# EAGLE schematic teensy-dsc (EAGLE 7.1.0)
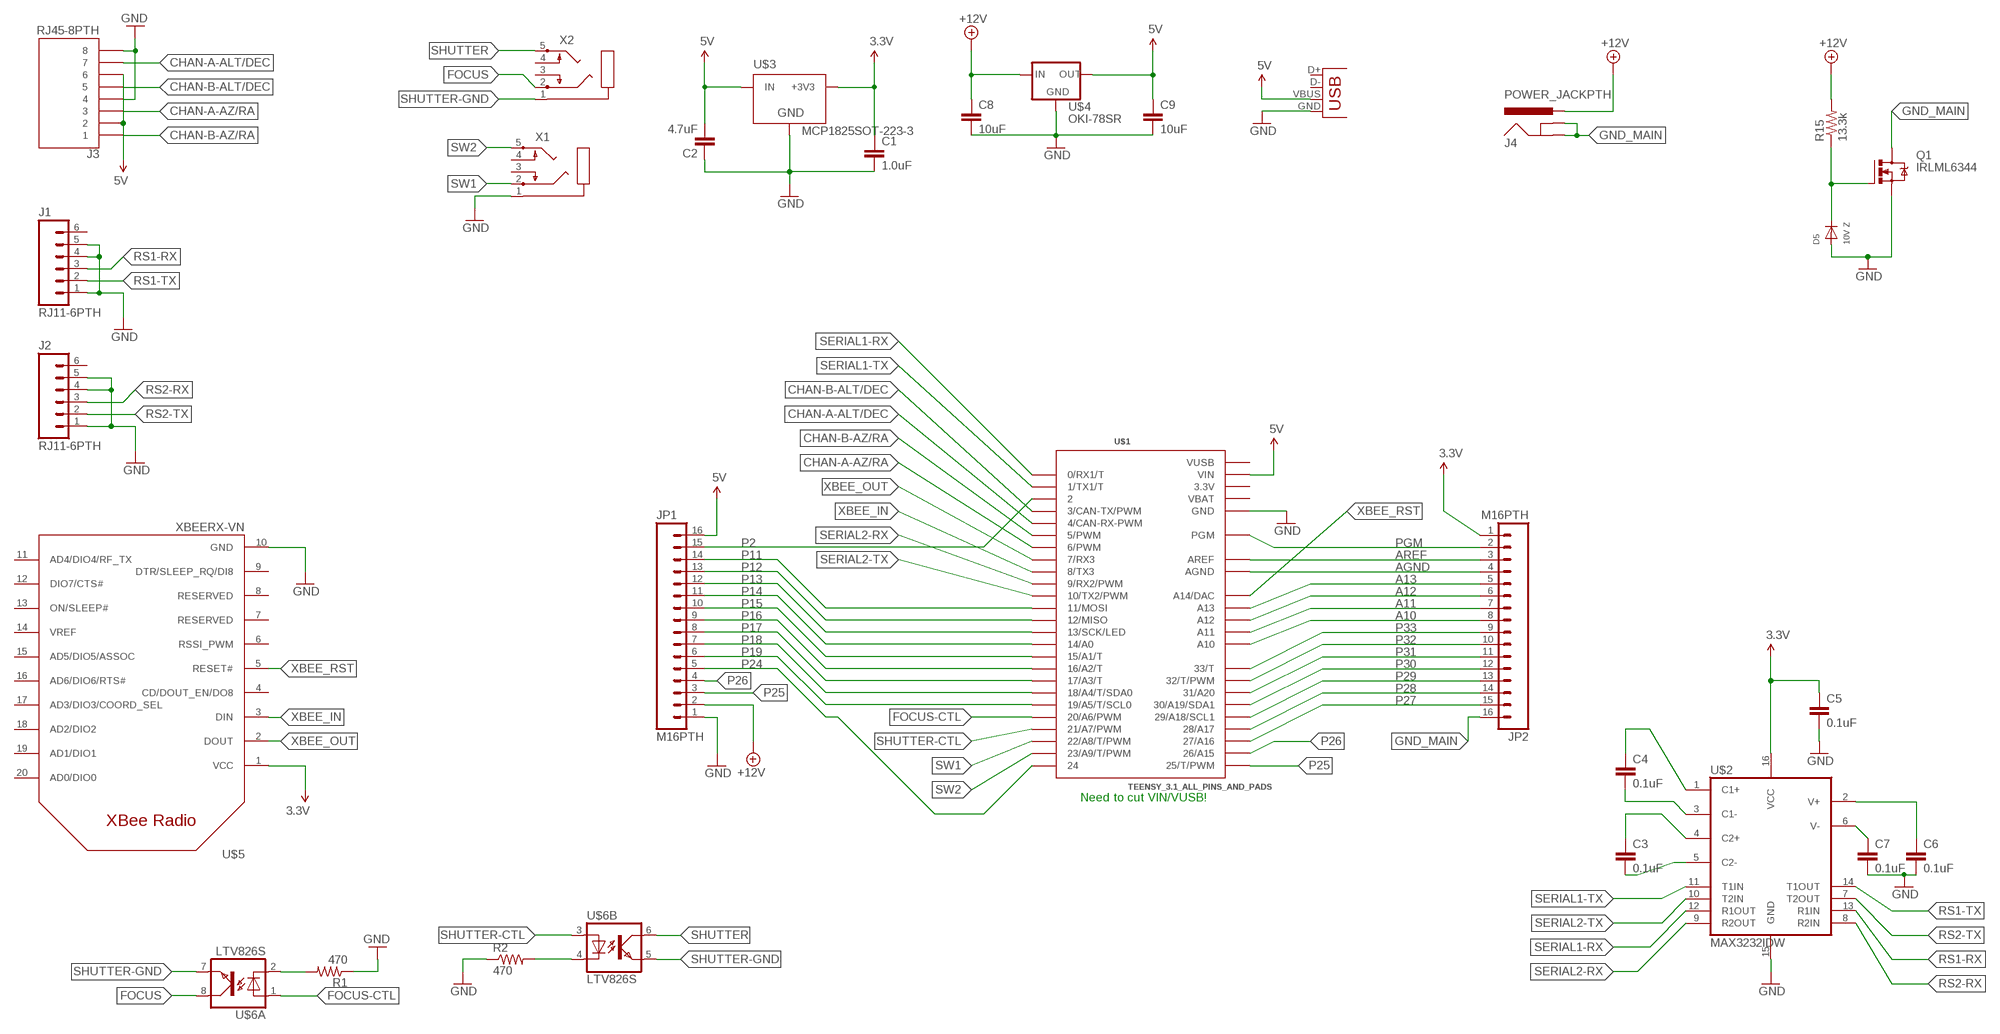
[diagram p0: schematic, sheet 1]

## Parts
C1  1.0uF  C-EUC0805  [C0805]
C2  4.7uF  C-EUC0805  [C0805]
C3  0.1uF  C-EUC0805  [C0805]
C4  0.1uF  C-EUC0805  [C0805]
C5  0.1uF  C-EUC0805  [C0805]
C6  0.1uF  C-EUC0805  [C0805]
C7  0.1uF  C-EUC0805  [C0805]
C8  10uF  C-EUC0805  [C0805]
C9  10uF  C-EUC0805  [C0805]
D5  10V Z  DIODESOD-123  [SOD-123]
J1  RJ11-6PTH  [RJ11-6]
J2  RJ11-6PTH  [RJ11-6]
J3  RJ45-8PTH  [RJ45-8]
J4  POWER_JACKPTH  [POWER_JACK_PTH]
J5  USB-B  USBPTH  [USB-B-PTH]
JP1  M16PTH  [1X16]
JP2  M16PTH  [1X16]
Q1  IRLML6344  [SOT23]
R1  470  R-US_M0805  [M0805]
R2  470  R-US_M0805  [M0805]
R15  13.3k  R-US_M0805  [M0805]
U$1  TEENSY_3.1_ALL_PINS_AND_PADS  [TEENSY_3.1_ALLPINS]
U$2  MAX3232IDW  MAX232SOIC16  [SO016]
U$3  MCP1825SOT-223-3  [SOT-223]
U$4  OKI-78SR  [OKI-78SR-H]
U$5  XBEERX-VN  [RX-VN]
U$6  LTV826S  [DIL8-SMD]
X1  STEREOJACK  [STX3100]
X2  STEREOJACK  [STX3100]

## Nets
3.3V [5V]: C1.1 C5.1 JP2.1 U$2.16(VCC) U$3.3(+3V3) U$5.1(VCC)
5V [5V]: C2.2 C9.1 J3.2 J3.6 J5.VBUS JP1.16 U$1.VIN U$3.1(IN) U$4.P$3(OUT)
+12V [12V]: C8.1 J4.PWR JP1.2 R15.2 U$4.P$1(IN)
A10: JP2.8 U$1.A10
A11: JP2.7 U$1.A11
A12: JP2.6 U$1.A12
A13: JP2.5 U$1.A13
AGND: JP2.4 U$1.AGND
AREF: JP2.3 U$1.AREF
CHAN-A-ALT/DEC: J3.7 U$1.4(4/CAN-RX-PWM)
CHAN-A-AZ/RA: J3.3 U$1.6(6/PWM)
CHAN-B-ALT/DEC: J3.5 U$1.3(3/CAN-TX/PWM)
CHAN-B-AZ/RA: J3.1 U$1.5(5/PWM)
FOCUS: U$6.8(A:COL) X2.2
FOCUS-CTL: U$1.20/A6(20/A6/PWM) U$6.1(A:A)
GND [GND]: C1.2 C2.1 C5.2 C6.2 C7.2 C8.2 C9.2 D5.A J1.1 J1.4 J1.5 J2.1 J2.4 J2.5 J3.4 J3.8 J5.GND JP1.1 Q1.2(S) R1.1 R2.1 U$1.GND U$1.GND1(GND) U$1.GND2(GND) U$2.15(GND) U$3.2(GND) U$4.P$2(GND) U$5.10(GND) X1.1
GND_MAIN [GND]: J4.GND J4.GNDBREAK JP2.16 Q1.3(D)
N$1: C4.1 U$2.1(C1+)
N$2: C4.2 U$2.3(C1-)
N$3: C3.1 U$2.4(C2+)
N$4: C3.2 U$2.5(C2-)
N$5: C7.1 U$2.6(V-)
N$6: C6.1 U$2.2(V+)
N$7: R2.2 U$6.4(B:C)
N$9: R1.2 U$6.2(A:C)
N$17: D5.C Q1.1(G) R15.1
P2: JP1.15 U$1.2
P11: JP1.14 U$1.11(11/MOSI)
P12: JP1.13 U$1.12(12/MISO)
P13: JP1.12 U$1.13(13/SCK/LED)
P14: JP1.11 U$1.14/A0
P15: JP1.10 U$1.15/A1(15/A1/T)
P16: JP1.9 U$1.16/A2(16/A2/T)
P17: JP1.8 U$1.17/A3(17/A3/T)
P18: JP1.7 U$1.18/A4(18/A4/T/SDA0)
P19: JP1.6 U$1.19/A5(19/A5/T/SCL0)
P24: JP1.5 U$1.24
P25: JP1.3 U$1.25(25/T/PWM)
P26: JP1.4 U$1.26(26/A15)
P27: JP2.15 U$1.27(27/A16)
P28: JP2.14 U$1.28(28/A17)
P29: JP2.13 U$1.29(29/A18/SCL1)
P30: JP2.12 U$1.30(30/A19/SDA1)
P31: JP2.11 U$1.31(31/A20)
P32: JP2.10 U$1.32(32/T/PWM)
P33: JP2.9 U$1.33(33/T)
PGM: JP2.2 U$1.PGM
RS1-RX: J1.3 U$2.13(R1IN)
RS1-TX: J1.2 U$2.14(T1OUT)
RS2-RX: J2.3 U$2.8(R2IN)
RS2-TX: J2.2 U$2.7(T2OUT)
SERIAL1-RX: U$1.0(0/RX1/T) U$2.12(R1OUT)
SERIAL1-TX: U$1.1(1/TX1/T) U$2.11(T1IN)
SERIAL2-RX: U$1.9(9/RX2/PWM) U$2.9(R2OUT)
SERIAL2-TX: U$1.10(10/TX2/PWM) U$2.10(T2IN)
SHUTTER: U$6.6(B:COL) X2.5
SHUTTER-CTL: U$1.21/A7(21/A7/PWM) U$6.3(B:A)
SHUTTER-GND [GND]: U$6.5(B:EMIT) U$6.7(A:EMIT) X2.1
SW1: U$1.22/A8(22/A8/T/PWM) X1.2
SW2: U$1.23/A9(23/A9/T/PWM) X1.5
XBEE_IN: U$1.8(8/TX3) U$5.3(DIN)
XBEE_OUT: U$1.7(7/RX3) U$5.2(DOUT)
XBEE_RST: U$1.A14(A14/DAC) U$5.5(RESET#)
Unconnected: J1.6 J2.6 J5.D+ J5.D- U$5.4(CD/DOUT_EN/DO8) U$5.6(RSSI_PWM) U$5.7(RESERVED) U$5.8(RESERVED) U$5.9(DTR/SLEEP_RQ/DI8) U$5.11(AD4/DIO4/RF_TX) U$5.12(DIO7/CTS#) U$5.13(ON/SLEEP#) U$5.14(VREF) U$5.15(AD5/DIO5/ASSOC) U$5.16(AD6/DIO6/RTS#) U$5.17(AD3/DIO3/COORD_SEL) U$5.18(AD2/DIO2) U$5.19(AD1/DIO1) U$5.20(AD0/DIO0) X1.3 X1.4 X2.3 X2.4

## Notes on the sheet
- Need to cut VIN/VUSB!

## Power pins joined to a net without a drawn wire
3.3V: U$1.3.3V U$1.3.3V1(3.3V) U$1.3.3V2(3.3V)
VBAT: U$1.VBAT
VUSB: U$1.VUSB

## Library data of the parts
C1-C7 = rcl:C-EU: CAPACITOR, European symbol
C8 C9 = resistor:C-EU: CAPACITOR, European symbol
D5 = adafruit:DIODE: Diode SMADIODE - SMA Surface Mount Package 20V 1A Schottky Diode Digikey: 641-1014-6-ND DO-1N4148 - Through Hole Small Current Diode SOD-123 20V 1 A (.5mV Vf) Schottky Diode - Digikey: MBRX120TPMSCT-ND SOD-323 10V 570mA (.38mV Vf, 3ns) Schottky Diode - Digikey: ZLLS410CT-ND SOD-523 30V 30mA Schottky Diode (RB751S-40TE61) - Digikey: RB751S-40TE61CT-ND SOT23-R/W - SOT23 Package (R = Solder Paste/Reflow Ovens, W = Hand-Soldering) BAT54Film 40V 300mA - Digikey: 497-7162-1-ND
J1 J2 = SparkFun-Connectors:RJ11-6: RJ11 Jack Simple 6 pin RJ11 jack. Commonly found on CAT3 devices and Microchip programmers. SKU: PRT-00132
J3 = SparkFun-Connectors:RJ45-8: RJ45 Jack Simple RJ45, 8-pin connection - connector for common Cat5, Cat5e, and Cat6 Ethernet cables. Footprint not yet proven in production. Connector sku is PRT-00643; Breakout PCB sku is BOB-00716.
J4 = SparkFun-Connectors:POWER_JACK: Power Jack This is the standard 5.5mm barrel jack for power. The PTH is the most common, proven, reliable, footprint. The Slot footprint only works if the mill layer is transmitted to the PCB fab house so be warned. Mating wall wart : TOL-00298 (and others); PROD_ID: PRT-00119
J5 = SparkFun-Connectors:USB: USB Connectors USB-B-PTH is fully proven SKU : PRT-00139/CONN-08278 USB-miniB is fully proven SKU : PRT-00587 USB-A-PCB is untested. USB-A-H is throughly reviewed, but untested. Spark Fun Electronics SKU : PRT-00437 USB-B-SMT is throughly reviewed, but untested. Needs silkscreen touching up. USB-A-S has not been used/tested USB-MB-H has not been used/tested USB-MICROB has been used. CONN-09505; PROD_ID: CONN-08278
JP1 JP2 = SparkFun-Connectors:M16: 1x16 .1" header
Q1 = synfinatic:IRLML6344: N-CHANNEL MOS FET
R1 R2 R15 = resistor:R-US_: RESISTOR, American symbol
U$1 = Teensy_3_Series_Board_v1.0:TEENSY_3.1_ALL_PINS_AND_PADS: Footprint for Teensy 3.1 board using all pads and all through-holes. Pads need a 2x7 0.1" SMD header.
U$2 = SparkFun-DigitalIC:MAX232: RS232 Transceiver Very common IC. This is generically called 'MAX232', but works with the 3V equivalent MAX3232 generic ICs. Field tested and mother approved. Spark Fun Electronics SKU : COM-00316 (DIP) and COM-00589 (SMD)
U$3 = SteelCaveRobotics-Power:MCP1825: MCP1825 3.3v LDO Linear Regulator
U$4 = synfinatic:OKI-78SR: Murata OKI-78SR LM78xx replacement
U$5 = xbee_r1:XBEE
U$6 = optocoupler:LTV826: OPTO COUPLER Source: LITEON, LTV816.pdf; OC_FARNELL: unknown; OC_NEWARK: unknown
X1 X2 = adafruit:STEREOJACK: MIC/HEADPHONE JACK Stereo jack with two switches. Kycon STX3100, CUI SJ1-3555NG and/or 4UCon 05544

## Net classes
0 default: width 0.152 mm
1 5V: width 0.254 mm, clearance 0.127 mm
2 GND: width 0.254 mm, clearance 0.127 mm
3 12V: width 0.254 mm, clearance 0.127 mm